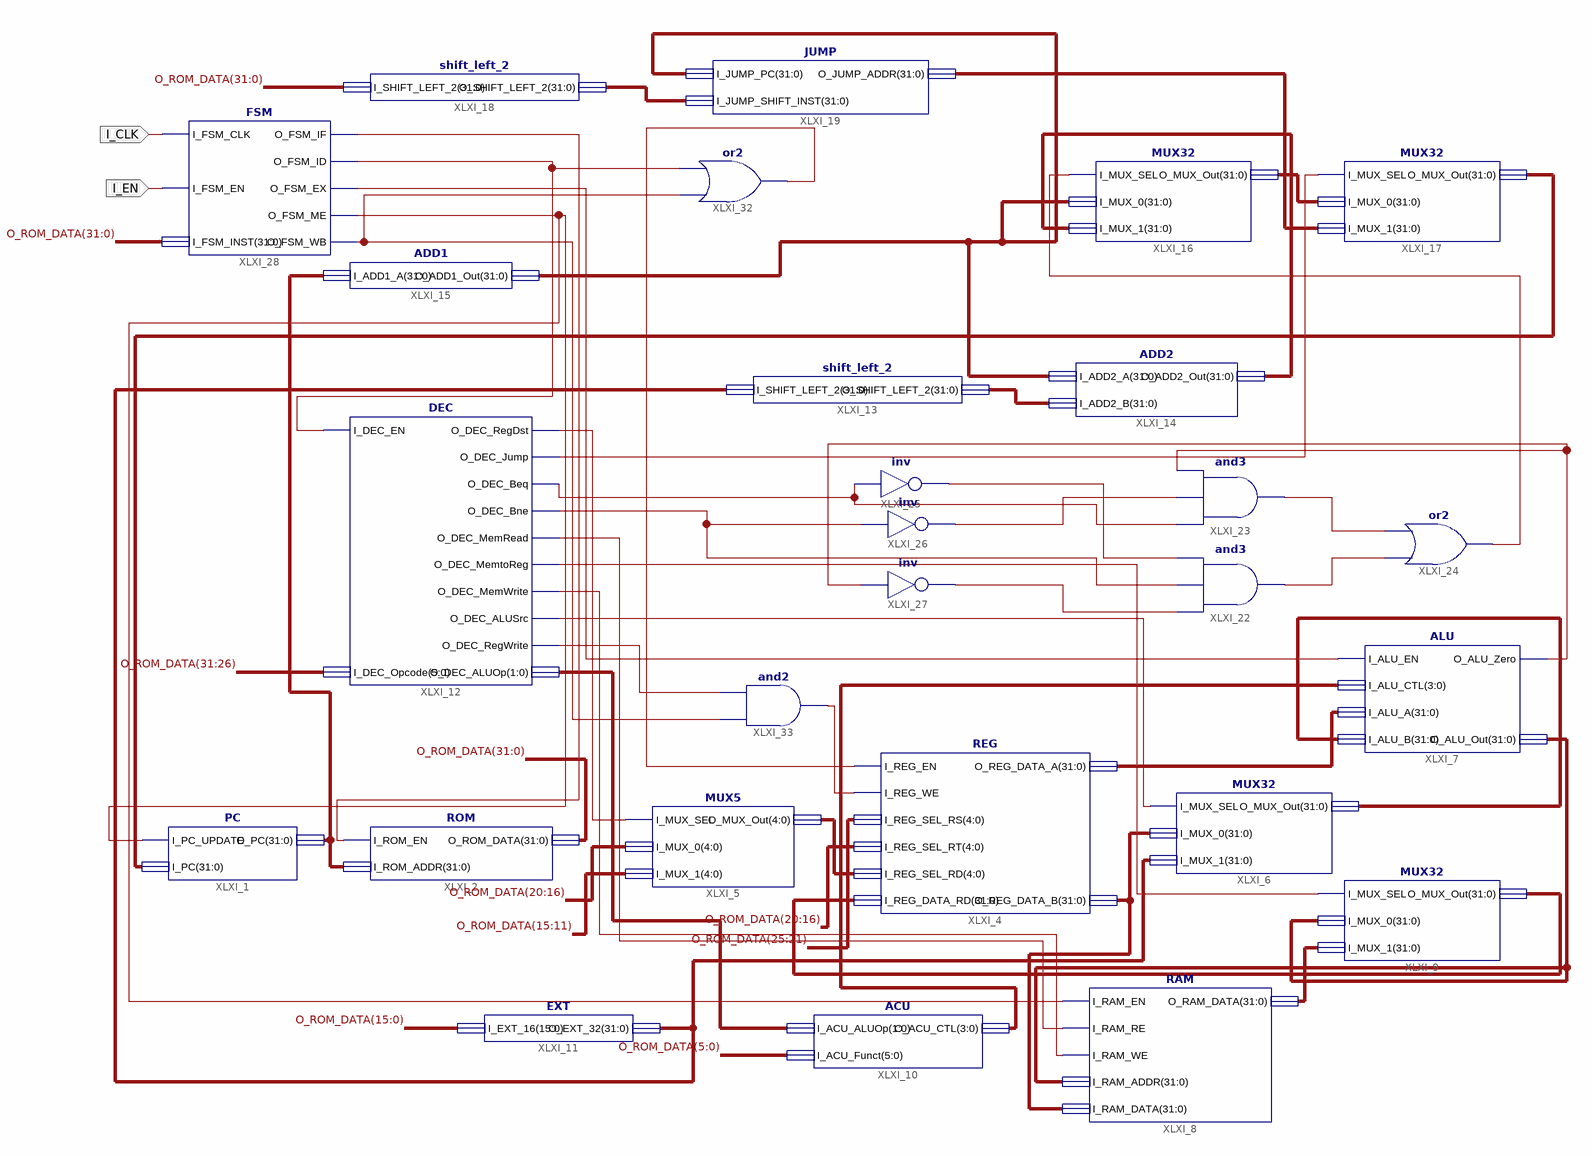
[diagram p0: schematic sheet 1]
// Xilinx ISE schematic CCSiMP32.sch (spartan3e) as structural Verilog: 27 symbols, 2 ports
module CCSiMP32 (
  input  I_CLK,
  input  I_EN
);

  wire XLXN_36, XLXN_37, XLXN_39, XLXN_40, XLXN_45, XLXN_56, XLXN_57, XLXN_61, XLXN_62, XLXN_64, XLXN_65,
       XLXN_66, XLXN_67, XLXN_68, XLXN_75, XLXN_91, XLXN_99, XLXN_103, XLXN_111, XLXN_112, XLXN_116,
       XLXN_118, XLXN_119;
  wire [1:0] XLXN_72;
  wire [3:0] XLXN_26;
  wire [4:0] XLXN_16;
  wire [31:0] O_ROM_DATA, XLXN_1, XLXN_19, XLXN_27, XLXN_31, XLXN_32, XLXN_33, XLXN_34, XLXN_35, XLXN_42,
       XLXN_46, XLXN_47, XLXN_52, XLXN_53, XLXN_54, XLXN_55;

  PC XLXI_1 (.I_PC_UPDATE(XLXN_91), .I_PC(XLXN_55), .O_PC(XLXN_1));
  ROM XLXI_2 (.I_ROM_EN(XLXN_75), .I_ROM_ADDR(XLXN_1), .O_ROM_DATA(O_ROM_DATA));
  REG XLXI_4 (
    .I_REG_EN(XLXN_103), .I_REG_WE(XLXN_119), .I_REG_SEL_RS(O_ROM_DATA[25:21]),
    .I_REG_SEL_RT(O_ROM_DATA[20:16]), .I_REG_SEL_RD(XLXN_16), .I_REG_DATA_RD(XLXN_31),
    .O_REG_DATA_A(XLXN_19), .O_REG_DATA_B(XLXN_27));
  MUX5 XLXI_5 (.I_MUX_SEL(XLXN_36), .I_MUX_0(O_ROM_DATA[20:16]), .I_MUX_1(O_ROM_DATA[15:11]), .O_MUX_Out(XLXN_16));
  MUX32 XLXI_6 (.I_MUX_SEL(XLXN_40), .I_MUX_0(XLXN_27), .I_MUX_1(XLXN_33), .O_MUX_Out(XLXN_34));
  ALU XLXI_7 (
    .I_ALU_EN(XLXN_111), .I_ALU_CTL(XLXN_26), .I_ALU_A(XLXN_19), .I_ALU_B(XLXN_34), .O_ALU_Zero(XLXN_64),
    .O_ALU_Out(XLXN_35));
  RAM XLXI_8 (
    .I_RAM_EN(XLXN_91), .I_RAM_RE(XLXN_37), .I_RAM_WE(XLXN_39), .I_RAM_ADDR(XLXN_35), .I_RAM_DATA(XLXN_27),
    .O_RAM_DATA(XLXN_32));
  MUX32 XLXI_9 (.I_MUX_SEL(XLXN_112), .I_MUX_0(XLXN_35), .I_MUX_1(XLXN_32), .O_MUX_Out(XLXN_31));
  ACU XLXI_10 (.I_ACU_ALUOp(XLXN_72), .I_ACU_Funct(O_ROM_DATA[5:0]), .O_ACU_CTL(XLXN_26));
  EXT XLXI_11 (.I_EXT_16(O_ROM_DATA[15:0]), .O_EXT_32(XLXN_33));
  DEC XLXI_12 (
    .I_DEC_EN(XLXN_99), .I_DEC_Opcode(O_ROM_DATA[31:26]), .O_DEC_RegDst(XLXN_36), .O_DEC_Jump(XLXN_45),
    .O_DEC_Beq(XLXN_56), .O_DEC_Bne(XLXN_57), .O_DEC_MemRead(XLXN_37), .O_DEC_MemtoReg(XLXN_112),
    .O_DEC_MemWrite(XLXN_39), .O_DEC_ALUSrc(XLXN_40), .O_DEC_RegWrite(XLXN_118), .O_DEC_ALUOp(XLXN_72));
  shift_left_2 XLXI_13 (.I_SHIFT_LEFT_2(XLXN_33), .O_SHIFT_LEFT_2(XLXN_42));
  ADD2 XLXI_14 (.I_ADD2_A(XLXN_53), .I_ADD2_B(XLXN_42), .O_ADD2_Out(XLXN_47));
  ADD1 XLXI_15 (.I_ADD1_A(XLXN_1), .O_ADD1_Out(XLXN_53));
  MUX32 XLXI_16 (.I_MUX_SEL(XLXN_68), .I_MUX_0(XLXN_53), .I_MUX_1(XLXN_47), .O_MUX_Out(XLXN_46));
  MUX32 XLXI_17 (.I_MUX_SEL(XLXN_45), .I_MUX_0(XLXN_46), .I_MUX_1(XLXN_54), .O_MUX_Out(XLXN_55));
  shift_left_2 XLXI_18 (.I_SHIFT_LEFT_2(O_ROM_DATA), .O_SHIFT_LEFT_2(XLXN_52));
  JUMP XLXI_19 (.I_JUMP_PC(XLXN_53), .I_JUMP_SHIFT_INST(XLXN_52), .O_JUMP_ADDR(XLXN_54));
  and XLXI_22 (XLXN_67, XLXN_61, XLXN_57, XLXN_62);
  and XLXI_23 (XLXN_66, XLXN_56, XLXN_65, XLXN_64);
  or XLXI_24 (XLXN_68, XLXN_67, XLXN_66);
  not XLXI_25 (XLXN_62, XLXN_56);
  not XLXI_26 (XLXN_65, XLXN_57);
  not XLXI_27 (XLXN_61, XLXN_64);
  FSM XLXI_28 (
    .I_FSM_CLK(I_CLK), .I_FSM_EN(I_EN), .I_FSM_INST(O_ROM_DATA), .O_FSM_IF(XLXN_75), .O_FSM_ID(XLXN_99),
    .O_FSM_EX(XLXN_111), .O_FSM_ME(XLXN_91), .O_FSM_WB(XLXN_116));
  or XLXI_32 (XLXN_103, XLXN_116, XLXN_99);
  and XLXI_33 (XLXN_119, XLXN_116, XLXN_118);
endmodule
